# EasyEDA schematic SCH_Project_BalanceCar_2024-01-19.json
TITLE: Blance Car; REV: 1.0; Date: 2023-05-17; Sheet: 1/1; Drawn By: Jia Sujian; Company: Viking
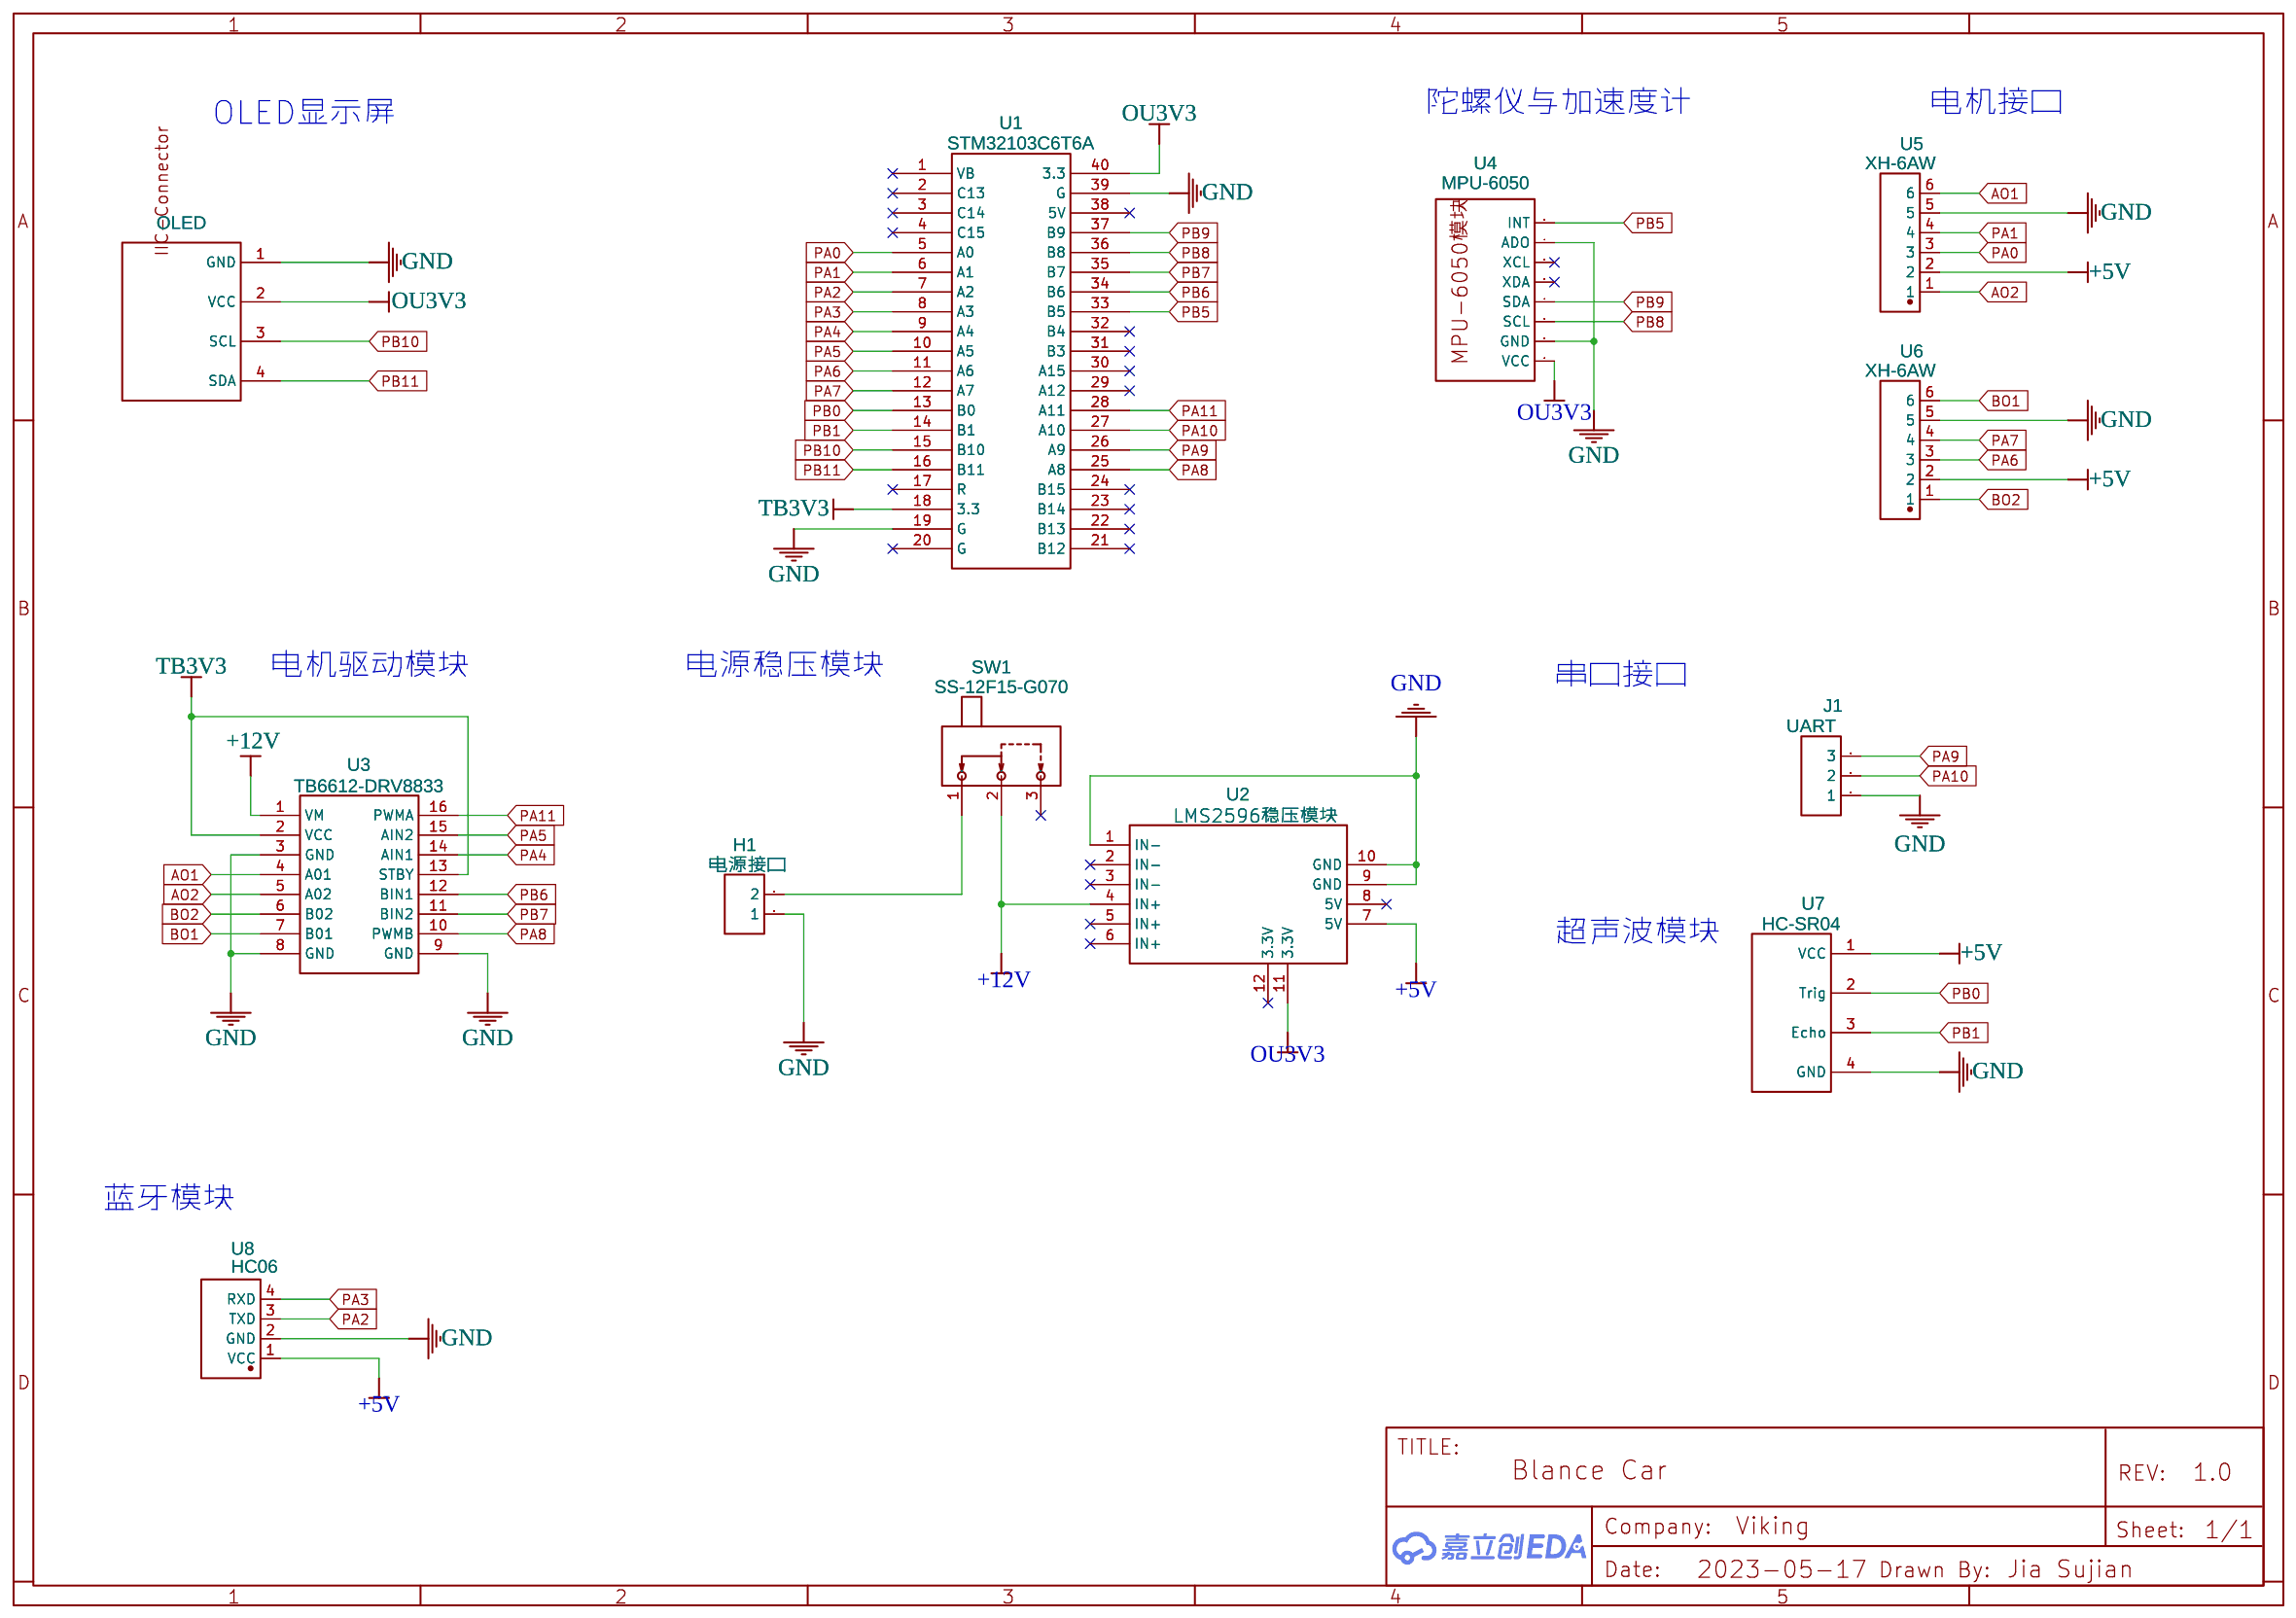
[diagram p0: schematic sheet]

## Parts
H1  电源接口  [HDR-F-2.54_1X2]
J1  UART  [HDR-M-2.54_1X3]
OLED  0.96OLED_4P_MODULE_JX  [0.96OLED_4P]
SW1  SS-12F15-G070  [SW-TH_SS-12F15-GXXX]
U1  STM32103C6T6A  [STM32F103C6T6A]
U2  LMS2596稳压模块  [LMS2596稳压模块封装]
U3  TB6612-DRV8833  [TB6612]
U4  MPU-6050  [MPU-6050模块]
U5  XH-6AW  [CONN-TH_6P-P2.50_DEALON_XH-6AW_C3010043]
U6  XH-6AW  [CONN-TH_6P-P2.50_DEALON_XH-6AW_C3010043]
U7  HC-SR04  [HC-SR04]
U8  HC06  [HC06]

## Library data of the parts
H1 = HDR-F-2.54_1x2: Supplier Part: C49661; Supplier: LCSC; Contributor: LCEDA_Lib
J1 = HDR-M-2.54_1x3: Supplier Part: C180248; Supplier: LCSC; Contributor: LCEDA_Lib
OLED = 0.96OLED_4P_MODULE_JX: Supplier: LCSC; Supplier Part: C9900004566; Manufacturer: null; Contributor: LCSC; JLCPCB Part Class: Extended Part
SW1 = SS-12F15-G070: Supplier: LCSC; Supplier Part: C2876018; Manufacturer: G-Switch(品赞); Contributor: LCSC; JLCPCB Part Class: Extended Part
U1 = STM32103C6T6A: Contributor: nxin
U2 = LMS2596稳压模块: Contributor: bobo2002
U3 = TB6612-DRV8833: Contributor: MAISIT
U4 = MPU-6050 六轴模块: Supplier: EasyEDA; Contributor: qdsanchuang
U5 U6 = XH-6AW_C3010043: Supplier: LCSC; Supplier Part: C3010043; Manufacturer: DEALON(德艺隆); link: https://atta.szlcsc.com/upload/public/pdf/source/20211108/AC6F7343EF2DAA680DFA4205A4E123C6.pdf; Contributor: lcsc
U7 = HC-SR04_超声波模块: Contributor: s2to
U8 = HC06: Contributor: lmnb66

## Nets
+5V: U2.7(5V) U5.2 U6.2 U7.1(VCC) U8.1(VCC)
+12V: SW1.2 U2.4(IN+) U3.1(VM)
GND: H1.1 J1.1 OLED.1(GND) U1.19(G) U1.39(G) U2.1(IN-) U2.9(GND) U2.10(GND) U3.3(GND) U3.8(GND) U3.9(GND) U4.2(GND) U4.7(ADO) U5.5 U6.5 U7.4(GND) U8.2(GND)
AO1: U3.4(A01) U5.6
AO2: U3.5(A02) U5.1
BO1: U3.7(B01) U6.6
BO2: U3.6(B02) U6.1
OU3V3: OLED.2(VCC) U1.40(3.3) U2.11(3.3V) U4.1(VCC)
PA0: U1.5(A0) U5.3
PA1: U1.6(A1) U5.4
PA2: U1.7(A2) U8.3(TXD)
PA3: U1.8(A3) U8.4(RXD)
PA4: U1.9(A4) U3.14(AIN1)
PA5: U1.10(A5) U3.15(AIN2)
PA6: U1.11(A6) U6.3
PA7: U1.12(A7) U6.4
PA8: U1.25(A8) U3.10(PWMB)
PA9: J1.3 U1.26(A9)
PA10: J1.2 U1.27(A10)
PA11: U1.28(A11) U3.16(PWMA)
PB0: U1.13(B0) U7.2(Trig)
PB1: U1.14(B1) U7.3(Echo)
PB5: U1.33(B5) U4.8(INT)
PB6: U1.34(B6) U3.12(BIN1)
PB7: U1.35(B7) U3.11(BIN2)
PB8: U1.36(B8) U4.3(SCL)
PB9: U1.37(B9) U4.4(SDA)
PB10: OLED.3(SCL) U1.15(B10)
PB11: OLED.4(SDA) U1.16(B11)
TB3V3: U1.18(3.3) U3.2(VCC) U3.13(STBY)
Net-(H1-2): H1.2 SW1.1

Not connected (* = marked no-connect by the designer): SW1 3*; U1 1(VB)* 2(C13)* 3(C14)* 4(C15)* 17(R)* 20(G)* 21(B12)* 22(B13)* 23(B14)* 24(B15)* 29(A12)* 30(A15)* 31(B3)* 32(B4)* 38(5V)*; U2 2(IN-)* 3(IN-)* 5(IN+)* 6(IN+)* 8(5V)* 12(3.3V)*; U4 5(XDA)* 6(XCL)*

## Notes on the sheet
- 陀螺仪与加速度计
- 电机接口
- OLED显示屏
- 电机驱动模块
- 电源稳压模块
- 串口接口
- 超声波模块
- 蓝牙模块
